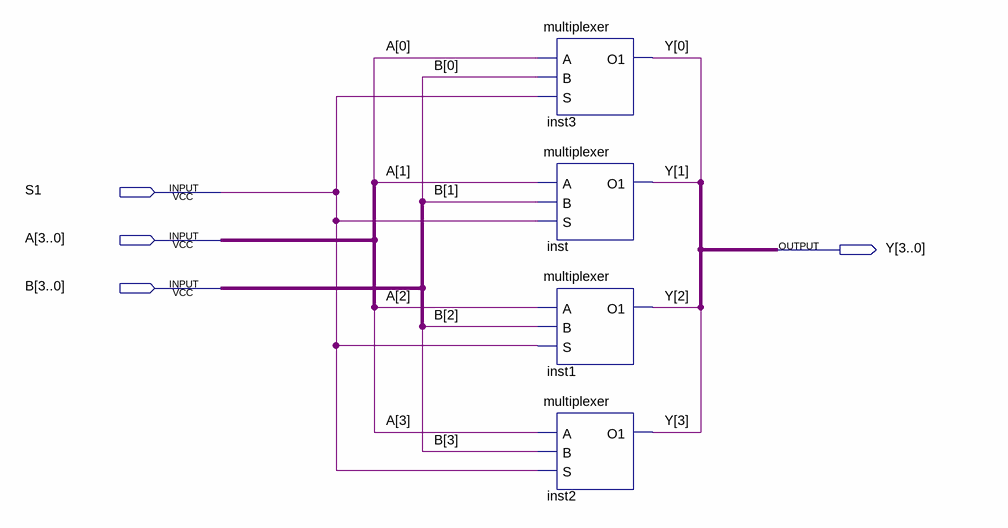
[diagram p0: schematic sheet]
// Quartus schematic fourbitsmultibdf.bdf as structural Verilog: 4 symbols, 4 pins
module fourbitsmultibdf (
  input  S1,
  input  [3:0] A,
  input  [3:0] B,
  output [3:0] Y
);

  multiplexer inst3 (.A(A[0]), .B(B[0]), .S(S1), .O1(Y[0]));
  multiplexer inst (.A(A[1]), .B(B[1]), .S(S1), .O1(Y[1]));
  multiplexer inst1 (.A(A[2]), .B(B[2]), .S(S1), .O1(Y[2]));
  multiplexer inst2 (.A(A[3]), .B(B[3]), .S(S1), .O1(Y[3]));
endmodule
